# Altium schematic sheet Magneto_diagnostics.SchDoc: Magneto
size 420 x 297 mm; Author: G.Kasprowicz; CompanyName: WUT ISE; DrawnBy: G.Kasprowicz; Organization: WUT ISE; Address1: PW ISE; Address2: Nowowiejska 15/19 00-665 Warsaw; Address3: gkasprow@gmail.com; DocumentNumber: 7; Revision: 2; SheetNumber: 7; SheetTotal: 7; ModifiedBy: -; CheckedDate: -; Title2: diagnostics; DivGrp: WUT ISE; Designer: G.Kasprowicz; ModifiedDate: -; ProjectName: Sensor Box
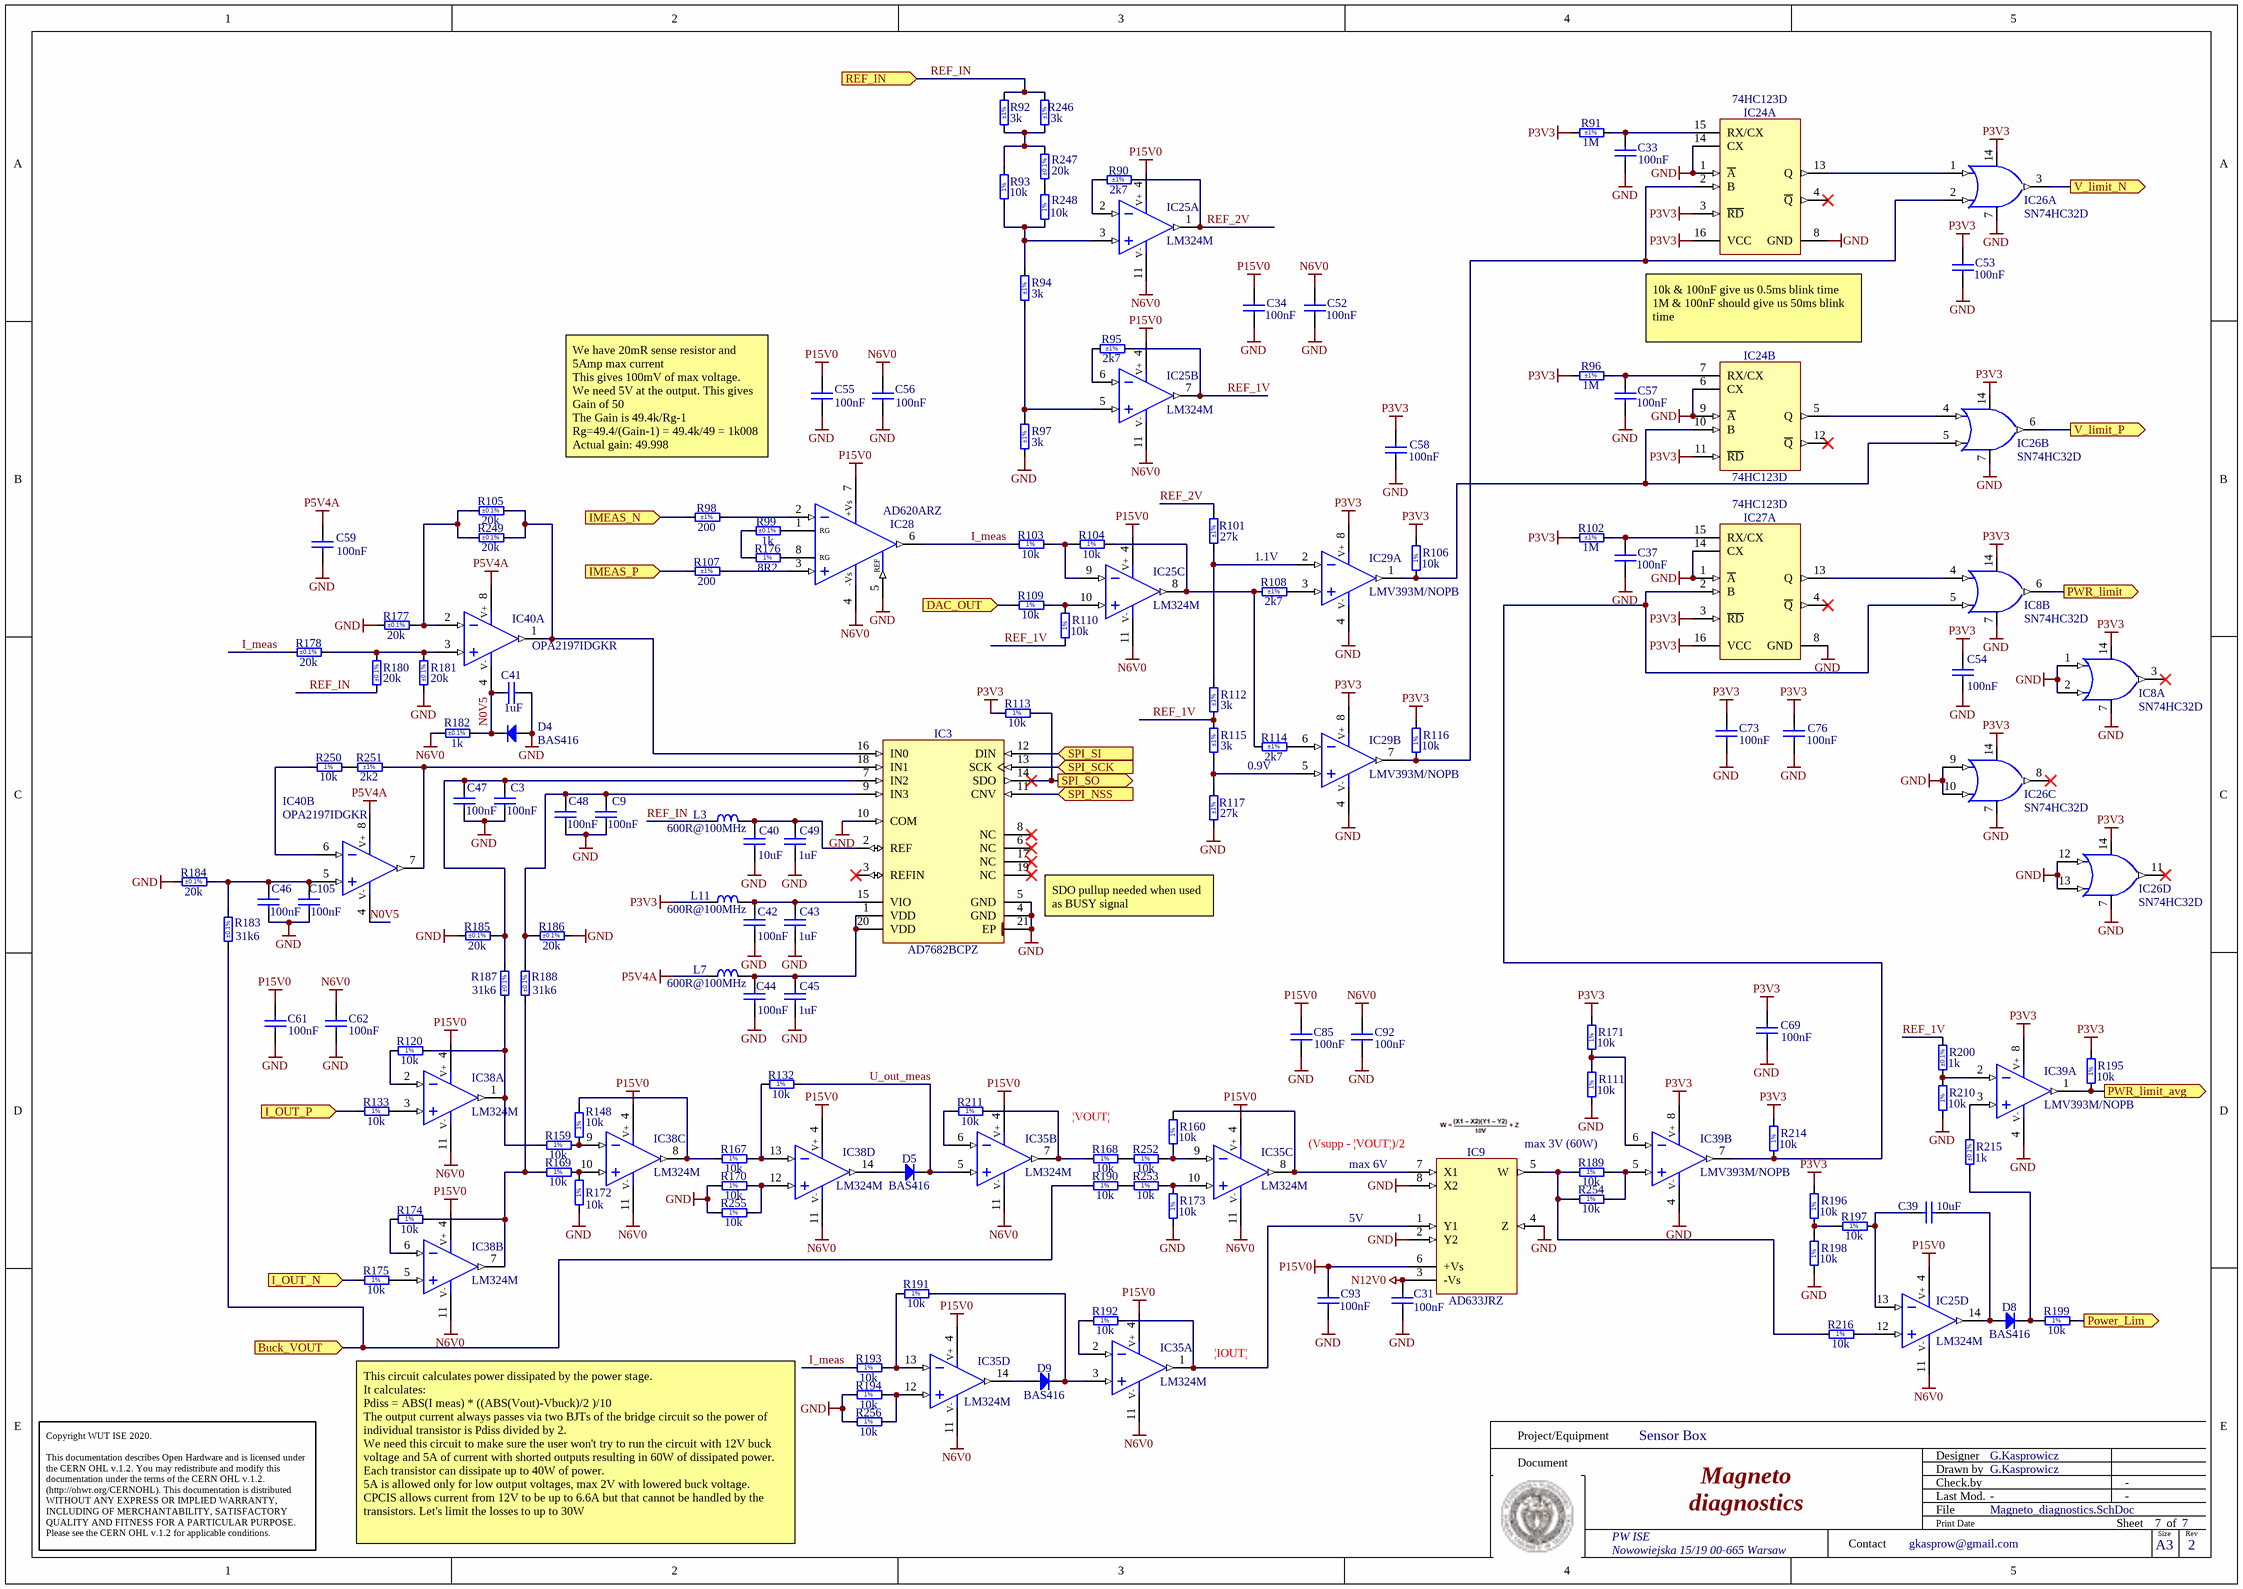
[diagram p0: Magneto_diagnostics.SchDoc]

## Parts
C3  100nF  [CAPC1005X55N]
C9  100nF  [CAPC1005X55N]
C31  100nF  [CAPC1005X55N]
C33  100nF  [CAPC1005X55N]
C34  100nF  [CAPC1005X55N]
C37  100nF  [CAPC1005X55N]
C39  10uF  [CAPC1608X80N]
C40  10uF  [CAPC1608X80N]
C41  1uF  [CAPC1608X87N]
C42  100nF  [CAPC1005X55N]
C43  1uF  [CAPC1608X87N]
C44  100nF  [CAPC1005X55N]
C45  1uF  [CAPC1608X87N]
C46  100nF  [CAPC1005X55N]
C47  100nF  [CAPC1005X55N]
C48  100nF  [CAPC1005X55N]
C49  1uF  [CAPC1608X87N]
C52  100nF  [CAPC1005X55N]
C53  100nF  [CAPC1005X55N]
C54  100nF  [CAPC1005X55N]
C55  100nF  [CAPC1005X55N]
C56  100nF  [CAPC1005X55N]
C57  100nF  [CAPC1005X55N]
C58  100nF  [CAPC1005X55N]
C59  100nF  [CAPC1005X55N]
C61  100nF  [CAPC1005X55N]
C62  100nF  [CAPC1005X55N]
C69  100nF  [CAPC1005X55N]
C73  100nF  [CAPC1005X55N]
C76  100nF  [CAPC1005X55N]
C85  100nF  [CAPC1005X55N]
C92  100nF  [CAPC1005X55N]
C93  100nF  [CAPC1005X55N]
C105  100nF  [CAPC1005X55N]
D4  BAS416  [SOD2512X110N]
D5  BAS416  [SOD2512X110N]
D8  BAS416  [SOD2512X110N]
D9  BAS416  [SOD2512X110N]
IC3  AD7682BCPZ  [QFN50P400X400X80-21N-S265]
IC8  SN74HC32D  [SOIC127P600X175-14N]  (parts A,B of 4)
IC9  AD633JRZ  [SOIC127P600X175-8N]
IC24  74HC123D  [SOIC127P600X175-16N]  (parts A,B of 2)
IC25  LM324M  [SOIC127P600X175-14N]  (parts A,B,C,D of 4)
IC26  SN74HC32D  [SOIC127P600X175-14N]  (parts A,B,C,D of 4)
IC27  74HC123D  [SOIC127P600X175-16N]  (part A of 2)
IC28  AD620ARZ  [SOIC127P600X175-8N]
IC29  LMV393M/NOPB  [SOIC127P600X175-8N]  (parts A,B of 2)
IC35  LM324M  [SOIC127P600X175-14N]  (parts A,B,C,D of 4)
IC38  LM324M  [SOIC127P600X175-14N]  (parts A,B,C,D of 4)
IC39  LMV393M/NOPB  [SOIC127P600X175-8N]  (parts A,B of 2)
IC40  OPA2197IDGKR  [SOP65P490X110-8N]  (parts A,B of 2)
L3  600R@100MHz  [INDC1005X55N]
L7  600R@100MHz  [INDC1005X55N]
L11  600R@100MHz  [INDC1005X55N]
R90  2k7  Tolerance: ±1%  [RESC1608X55N]
R91  1M  Tolerance: ±1%  [RESC1608X55N]
R92  3k  Tolerance: ±1%  [RESC1005X40N]
R93  10k  [RESC1005X40N]
R94  3k  Tolerance: ±1%  [RESC1005X40N]
R95  2k7  Tolerance: ±1%  [RESC1608X55N]
R96  1M  Tolerance: ±1%  [RESC1608X55N]
R97  3k  Tolerance: ±1%  [RESC1005X40N]
R98  200  Tolerance: ±1%  [RESC1608X55N]
R99  1k  Tolerance: ±0.1%  [RESC1608X55N]
R101  27k  Tolerance: ±1%  [RESC1608X55N]
R102  1M  Tolerance: ±1%  [RESC1608X55N]
R103  10k  [RESC1005X40N]
R104  10k  [RESC1005X40N]
R105  20k  Tolerance: ±0.1%  [RESC1608X55N]
R106  10k  [RESC1005X40N]
R107  200  Tolerance: ±1%  [RESC1608X55N]
R108  2k7  Tolerance: ±1%  [RESC1608X55N]
R109  10k  [RESC1005X40N]
R110  10k  [RESC1005X40N]
R111  10k  [RESC1005X40N]
R112  3k  Tolerance: ±1%  [RESC1005X40N]
R113  10k  [RESC1005X40N]
R114  2k7  Tolerance: ±1%  [RESC1608X55N]
R115  3k  Tolerance: ±1%  [RESC1005X40N]
R116  10k  [RESC1005X40N]
R117  27k  Tolerance: ±1%  [RESC1608X55N]
R120  10k  [RESC1005X40N]
R132  10k  [RESC1005X40N]
R133  10k  [RESC1005X40N]
R148  10k  [RESC1005X40N]
R159  10k  [RESC1005X40N]
R160  10k  [RESC1005X40N]
R167  10k  [RESC1005X40N]
R168  10k  [RESC1005X40N]
R169  10k  [RESC1005X40N]
R170  10k  [RESC1005X40N]
R171  10k  [RESC1005X40N]
R172  10k  [RESC1005X40N]
R173  10k  [RESC1005X40N]
R174  10k  [RESC1005X40N]
R175  10k  [RESC1005X40N]
R176  8R2  [RESC1608X55N]
R177  20k  Tolerance: ±0.1%  [RESC1608X55N]
R178  20k  Tolerance: ±0.1%  [RESC1608X55N]
R180  20k  Tolerance: ±0.1%  [RESC1608X55N]
R181  20k  Tolerance: ±0.1%  [RESC1608X55N]
R182  1k  Tolerance: ±0.1%  [RESC1608X55N]
R183  31k6  Tolerance: ±0.1%  [RESC1005X35N]
R184  20k  Tolerance: ±0.1%  [RESC1608X55N]
R185  20k  Tolerance: ±0.1%  [RESC1608X55N]
R186  20k  Tolerance: ±0.1%  [RESC1608X55N]
R187  31k6  Tolerance: ±0.1%  [RESC1005X35N]
R188  31k6  Tolerance: ±0.1%  [RESC1005X35N]
R189  10k  [RESC1005X40N]
R190  10k  [RESC1005X40N]
R191  10k  [RESC1005X40N]
R192  10k  [RESC1005X40N]
R193  10k  [RESC1005X40N]
R194  10k  [RESC1005X40N]
R195  10k  [RESC1005X40N]
R196  10k  [RESC1005X40N]
R197  10k  [RESC1005X40N]
R198  10k  [RESC1005X40N]
R199  10k  [RESC1005X40N]
R200  1k  Tolerance: ±0.1%  [RESC1608X55N]
R210  10k  [RESC1005X40N]
R211  10k  [RESC1005X40N]
R214  10k  [RESC1005X40N]
R215  1k  Tolerance: ±0.1%  [RESC1608X55N]
R216  10k  [RESC1005X40N]
R246  3k  Tolerance: ±1%  [RESC1005X40N]
R247  20k  Tolerance: ±0.1%  [RESC1608X55N]
R248  10k  [RESC1005X40N]
R249  20k  Tolerance: ±0.1%  [RESC1608X55N]
R250  10k  [RESC1005X40N]
R251  2k2  Tolerance: ±1%  [RESC1608X55N]
R252  10k  [RESC1005X40N]
R253  10k  [RESC1005X40N]
R254  10k  [RESC1005X40N]
R255  10k  [RESC1005X40N]
R256  10k  [RESC1005X40N]

## Ports
Buck_VOUT (in), DAC_OUT (in), I_OUT_N (in), I_OUT_P (in), IMEAS_N (in), IMEAS_P (in), Power_Lim (out), PWR_limit (out), PWR_limit_avg (out), REF_IN (in), SPI_NSS (in), SPI_SCK (in), SPI_SI (in), SPI_SO (out), V_limit_N (out), V_limit_P (out)

## Nets
GND: C3.1 C9.1 C31.1 C33.1 C34.1 C37.1 C40.1 C41.1 C42.1 C43.1 C44.1 C45.1 C46.1 C47.1 C48.1 C49.1 C52.1 C53.1 C54.1 C55.1 C56.1 C57.1 C58.1 C59.1 C61.1 C62.1 C69.1 C73.1 C76.1 C85.1 C92.1 C93.1 C105.1 D4.2(A) IC3.4(GND) IC3.5(GND) IC3.10(COM) IC3.21(EP) IC8.1(A) IC8.2(B) IC8.7(GND) IC9.2(Y2) IC9.4(Z) IC9.8(X2) IC24.1(~{A}) IC24.6(CX) IC24.8(GND) IC24.9(~{A}) IC24.14(CX) IC26.7(GND) IC26.9(A) IC26.10(B) IC26.12(A) IC26.13(B) IC27.1(~{A}) IC27.8(GND) IC27.14(CX) IC28.5(REF) IC29.4(V-) IC39.4(V-) R97.1 R111.1 R117.1 R170.1 R172.1 R173.1 R177.1 R181.1 R184.1 R185.1 R186.2 R194.1 R198.1 R210.1 R255.1 R256.1
N6V0: C52.2 C56.2 C62.2 C92.2 IC25.11(V-) IC28.4(-Vs) IC35.11(V-) IC38.11(V-) R182.1
N12V0: C31.2 IC9.3(-Vs)
P3V3: C53.2 C54.2 C58.2 C69.2 C73.2 C76.2 IC8.14(VCC) IC24.3(~{RD}) IC24.11(~{RD}) IC24.16(VCC) IC26.14(VCC) IC27.3(~{RD}) IC27.16(VCC) IC29.8(V+) IC39.8(V+) L11.1 R91.1 R96.1 R102.1 R106.2 R113.1 R116.2 R171.2 R195.2 R196.2 R214.2
P5V4A: C59.2 IC40.8(V+) L7.1
P15V0: C34.2 C55.2 C61.2 C85.2 C93.2 IC9.6(+Vs) IC25.4(V+) IC28.7(+Vs) IC35.4(V+) IC38.4(V+)
Buck_VOUT: R183.1 R190.1 ; port Buck_VOUT
DAC_OUT: R109.1 ; port DAC_OUT
I_meas: IC28.6(Vout) R103.1 R178.1 R193.1
I_OUT_N: R175.1 ; port I_OUT_N
I_OUT_P: R133.1 ; port I_OUT_P
IMEAS_N: R98.1 ; port IMEAS_N
IMEAS_P: R107.1 ; port IMEAS_P
N0V5: C41.2 D4.1(C) IC40.4(V-) R182.2
Power_Lim: R199.2 ; port Power_Lim
PWR_limit: IC8.6(Y) ; port PWR_limit
PWR_limit_avg: IC39.1(OUT) R195.1 ; port PWR_limit_avg
REF_1V: IC25.7(OUT) R95.2 R110.1 R112.1 R115.2 R200.2
REF_2V: IC25.1(OUT) R90.2 R101.2
REF_IN: L3.1 R92.2 R180.1 R246.2 ; port REF_IN
SPI_NSS: IC3.11(CNV) ; port SPI_NSS
SPI_SCK: IC3.13(SCK) ; port SPI_SCK
SPI_SI: IC3.12(DIN) ; port SPI_SI
SPI_SO: IC3.14(SDO) R113.2 ; port SPI_SO
U_out_meas: D5.1(C) IC35.5(IN+) R132.2
V_limit_N: IC26.3(Y) ; port V_limit_N
V_limit_P: IC26.6(Y) ; port V_limit_P
NetC3_2: C3.2 C47.2 IC3.7(IN2) R185.2 R187.2
NetC9_2: C9.2 C48.2 IC3.9(IN3) R186.1 R188.2
NetC33_2: C33.2 IC24.15(RX/CX) R91.2
NetC37_2: C37.2 IC27.15(RX/CX) R102.2
NetC39_1: C39.1 D8.2(A) IC25.14(OUT)
NetC39_2: C39.2 IC25.13(IN-) R197.2
NetC40_2: C40.2 C49.2 IC3.2(REF) L3.2
NetC42_2: C42.2 C43.2 IC3.15(VIO) L11.2
NetC44_2: C44.2 C45.2 IC3.1(VDD) IC3.20(VDD) L7.2
NetC46_2: C46.2 C105.2 IC40.5(IN+) R183.2 R184.2
NetC57_2: C57.2 IC24.7(RX/CX) R96.2
NetD5_2: D5.2(A) IC38.14(OUT)
NetD8_1: D8.1(C) R199.1 R215.1
NetD9_1: D9.1(C) IC35.3(IN+) R191.2
NetD9_2: D9.2(A) IC35.14(OUT)
NetIC3_16: IC3.16(IN0) IC40.1(OUT) R105.2 R249.2
NetIC3_18: IC3.18(IN1) IC40.7(OUT) R251.2
NetIC8_4: IC8.4(A) IC27.13(Q)
NetIC8_5: IC8.5(B) IC27.2(B) IC39.7(OUT) R214.1
NetIC9_1: IC9.1(Y1) IC35.1(OUT) R192.2
NetIC9_5: IC9.5(W) R189.1 R216.1 R254.1
NetIC9_7: IC9.7(X1) IC35.8(OUT) R160.2
NetIC24_2: IC24.2(B) IC26.2(B) IC29.7(OUT) R116.1
NetIC24_5: IC24.5(Q) IC26.4(A)
NetIC24_10: IC24.10(B) IC26.5(B) IC29.1(OUT) R106.1
NetIC24_13: IC24.13(Q) IC26.1(A)
NetIC25_2: IC25.2(IN-) R90.1
NetIC25_3: IC25.3(IN+) R93.1 R94.2 R248.1
NetIC25_5: IC25.5(IN+) R94.1 R97.2
NetIC25_6: IC25.6(IN-) R95.1
NetIC25_8: IC25.8(OUT) R104.2 R108.1 R114.1
NetIC25_9: IC25.9(IN-) R103.2 R104.1
NetIC25_10: IC25.10(IN+) R109.2 R110.2
NetIC25_12: IC25.12(IN+) R216.2
NetIC28_1: IC28.1(-RG) R99.2
NetIC28_2: IC28.2(-IN) R98.2
NetIC28_3: IC28.3(+IN) R107.2
NetIC28_8: IC28.8(+RG) R176.2
NetIC29_2: IC29.2(IN-) R101.1 R112.2
NetIC29_3: IC29.3(IN+) R108.2
NetIC29_5: IC29.5(IN+) R115.1 R117.2
NetIC29_6: IC29.6(IN-) R114.2
NetIC35_2: IC35.2(IN-) R192.1
NetIC35_6: IC35.6(IN-) R211.1
NetIC35_7: IC35.7(OUT) R168.1 R211.2
NetIC35_9: IC35.9(IN-) R160.1 R252.2
NetIC35_10: IC35.10(IN+) R173.2 R253.2
NetIC35_12: IC35.12(IN+) R194.2 R256.2
NetIC35_13: IC35.13(IN-) R191.1 R193.2
NetIC38_1: IC38.1(OUT) R120.2 R159.1 R187.1
NetIC38_2: IC38.2(IN-) R120.1
NetIC38_3: IC38.3(IN+) R133.2
NetIC38_5: IC38.5(IN+) R175.2
NetIC38_6: IC38.6(IN-) R174.1
NetIC38_7: IC38.7(OUT) R169.1 R174.2 R188.1
NetIC38_8: IC38.8(OUT) R148.2 R167.1
NetIC38_9: IC38.9(IN-) R148.1 R159.2
NetIC38_10: IC38.10(IN+) R169.2 R172.2
NetIC38_12: IC38.12(IN+) R170.2 R255.2
NetIC38_13: IC38.13(IN-) R132.1 R167.2
NetIC39_2: IC39.2(IN-) R200.1 R210.2
NetIC39_3: IC39.3(IN+) R215.2
NetIC39_5: IC39.5(IN+) R189.2 R254.2
NetIC39_6: IC39.6(IN-) R111.2 R171.1
NetIC40_2: IC40.2(IN-) R105.1 R177.2 R249.1
NetIC40_3: IC40.3(IN+) R178.2 R180.2 R181.2
NetIC40_6: IC40.6(IN-) R250.1
NetR92_1: R92.1 R93.2 R246.1 R247.2
NetR99_1: R99.1 R176.1
NetR168_2: R168.2 R252.1
NetR190_2: R190.2 R253.1
NetR196_1: R196.1 R197.1 R198.2
NetR247_1: R247.1 R248.2
NetR250_2: R250.2 R251.1

Not connected (* = marked no-connect by the designer): IC3 3(REFIN)* 6(NC)* 8(NC)* 17(NC)* 19(NC)*; IC8 3(Y)*; IC24 4(~{Q})* 12(~{Q})*; IC26 8(Y)* 11(Y)*; IC27 4(~{Q})*

## Notes on the sheet
- (near IC24) 10k & 100nF give us 0.5ms blink time
  1M & 100nF should give us 50ms blink time
- We have 20mR sense resistor and 5Amp max current
  This gives 100mV of max voltage.
  We need 5V at the output. This gives Gain of 50
  The Gain is 49.4k/Rg-1
  Rg=49.4/(Gain-1) = 49.4k/49 = 1k008
  Actual gain: 49.998
- 1.1V
- (near R114) 0.9V
- SDO pullup needed when used as BUSY signal
- |VOUT|
- (Vsupp - |VOUT|)/2
- max 6V
- max 3V (60W)
- 5V
- (near IC35) |IOUT|
- This circuit calculates power dissipated by the power stage.
  It calculates:
  Pdiss = ABS(I meas) * ((ABS(Vout)-Vbuck)/2 )/10
  The output current always passes via two BJTs of the bridge circuit so the power of individual transistor is Pdiss divided by 2.
  We need this circuit to make sure the user won't try to run the circuit with 12V buck voltage and 5A of current with shorted outputs resulting in 60W of dissipated power. Each transistor can dissipate up to 40W of power.
  5A is allowed only for low output voltages, max 2V with lowered buck voltage.
  CPCIS allows current from 12V to be up to 6.6A but that cannot be handled by the transistors. Let's limit the losses to up to 30W
- Project/Equipment
- Document
- Designer
- Drawn by
- Check.by
- Copyright WUT ISE 2020.
  This documentation describes Open Hardware and is licensed under the CERN OHL v.1.2. You may redistribute and modify this documentation under the terms of the CERN OHL v.1.2. (http://ohwr.org/CERNOHL). This documentation is distributed WITHOUT ANY EXPRESS OR IMPLIED WARRANTY, INCLUDING OF MERCHANTABILITY, SATISFACTORY QUALITY AND FITNESS FOR A PARTICULAR PURPOSE. Please see the CERN OHL v.1.2 for applicable conditions.
- Contact
- File
- Last Mod.
- Print Date
- Sheet
- Size
- A3
- of
- Rev
- (in symbol AD620ARZ) RG
- (in symbol R0402_10K_1%_0.0625W_100PPM) 1%
- (in symbol R0603_8R2_1%_0.1W_200PPM) 1%

## Library data of the parts
C3 C9 C31 C33 C34 C37 C42 C44 C46-C48 C52-C59 C61 C62 C69 C73 C76 C85 C92 C93 C105 = CC0402_100NF_16V_10%_X5R: Non-polarised capacitor; Part Description: SMD Multilayer Chip Ceramic Capacitor; Manufacturer: GENERIC; Manufacturer1 Part Number: GRM155R61C104KA88D; Voltage: 16V; TC: X5R; Tolerance: ±10%; Part Number: CC0402_100NF_16V_10%_X5R; Component Kind: Standard; Component Type: Standard; Pin Count: 2; Value: 100nF; Status: None; Manufacturer Part Number: CC0402_100NF_16V_10%_X5R; Case: 0402; Mounted: Yes; Socket: No; SMD: Yes; Sense: No; Manufacturer1 Example: MURATA; Manufacturer1 ComponentHeight: 0.55mm; HelpURL: \\cern.ch\dfs\Applications\Altium\Datasheets\CC0402_X5R_MURATA_GRM.pdf; Author: CERN DEM JLC; CreateDate: 10.12.2013; LatestRevisionDate: 10.12.2013
C39 C40 = CC0603_10UF_16V_20%_X5R: Non-polarised capacitor; Part Description: SMD Multilayer Chip Ceramic Capacitor; Manufacturer: GENERIC; Manufacturer1 Part Number: GRM188R61C106MA73D; Voltage: 16V; TC: X5R; Tolerance: ±20%; Part Number: CC0603_10UF_16V_20%_X5R; Component Kind: Standard; Component Type: Standard; Pin Count: 2; Value: 10uF; Status: None; Manufacturer Part Number: CC0603_10UF_16V_20%_X5R; Case: 0603; Mounted: Yes; Socket: No; SMD: Yes; Sense: No; Manufacturer1 Example: MURATA; Manufacturer1 ComponentHeight: 0.8mm; HelpURL: \\cern.ch\dfs\Applications\Altium\Datasheets\CC0603_X5R_MURATA_GRM.pdf; Author: CERN DEM MR; CreateDate: 02.03.2016; LatestRevisionDate: 02.03.2016
C41 C43 C45 C49 = CC0603_1UF_25V_10%_X7R: Non-polarised capacitor; Part Description: SMD Multilayer Chip Ceramic Capacitor; Manufacturer: GENERIC; Manufacturer1 Part Number: GCM188R71E105KA64D; Voltage: 25V; TC: X7R; Tolerance: ±10%; Part Number: CC0603_1UF_25V_10%_X7R; Component Kind: Standard; Component Type: Standard; Pin Count: 2; Value: 1uF; Status: None; Manufacturer Part Number: CC0603_1UF_25V_10%_X7R; Case: 0603; Mounted: Yes; Socket: No; SMD: Yes; Sense: No; Manufacturer1 Example: MURATA; Manufacturer1 ComponentHeight: 0.9mm; HelpURL: \\cern.ch\dfs\Applications\Altium\Datasheets\CC0603_X7R_MURATA.pdf; Author: CERN DEM JLC; CreateDate: 18.01.2011; LatestRevisionDate: 18.01.2011
D4 D5 D8 D9 = BAS416: Diode; Part Description: Low-Leakage Diode; Manufacturer1: NXP SEMICONDUCTORS; Manufacturer1 Part Number: BAS416,115; Voltage: 75V; Power: 200mA; PressFit: No; Bonding: No; Part Number: BAS416; Component Kind: Standard; Component Type: Standard; Device: BAS416; PackageDescription: Small Outline Diode (SOD-323), 1.70mm W X 1.25mm L X 1.10mm H body,  IPC Medium Density; Pin Count: 2; Case: SOD-323; Mounted: Yes; Socket: No; SMD: Yes; Sense: No; ComponentHeight: 1.1mm; HelpURL: \\cern.ch\dfs\Applications\Altium\Datasheets\BAS416.pdf; Author: CERN DEM JLC; CreateDate: 01.10.2013; LatestRevisionDate: 01.10.2013
IC3 = AD7682BCPZ: 16-Bit, 4-Channel, 250 kSPS PulSAR ADC; Manufacturer1: ANALOG DEVICES; Manufacturer1 Part Number: AD7682BCPZRL7; PressFit: No; Bonding: No; Part Number: AD7682BCPZ; Component Kind: Standard; Component Type: Standard; Device: AD7682BCPZ; PackageDescription: QFN, 0.50mm Pitch, Square; 20 Pin, 4.00mm L X 4.00mm W X 0.80mm H Body (w/Thermal Tab 2.75 X 2.75mm), IPC Medium Density; Part Description: 16-Bit, 4-Channel, 250 kSPS PulSAR ADC; Pin Count: 21; Case: QFN20; Mounted: Yes; Socket: No; SMD: Yes; Sense: No; ComponentHeight: 0.8mm; Author: CERN DEM JLC; HelpURL: \\cern.ch\dfs\Applications\Altium\Datasheets\AD7682BCPZ.pdf; CreateDate: 21.08.2017; LatestRevisionDate: 23.03.2022
IC8 IC26 = SN74HC32D: Quad 2-Input OR Gate; Part Description: Quadruple 2-Input Positive-OR Gate; Manufacturer1: TEXAS INSTRUMENTS; PressFit: No; Bonding: No; Part Number: SN74HC32D; Component Kind: Standard; Component Type: Standard; Device: SN74HC32D; PackageDescription: SOIC 14, Pitch 1.27mm - Body 4x8.75mm, IPC Medium Density; Manufacturer1 Part Number: SN74HC32D; Pin Count: 14; Case: SOIC14; Mounted: Yes; Socket: No; SMD: Yes; Sense: No; ComponentHeight: 1.75mm; Author: CERN DEM JLC; HelpURL: \\cern.ch\dfs\Applications\Altium\Datasheets\SN74HC32D.pdf; CreateDate: 18/03/2014; LatestRevisionDate: 18/03/2014
IC9 = AD633JRZ: Low Cost Analog Multiplier; Manufacturer1: ANALOG DEVICES; PressFit: No; Bonding: No; Part Number: AD633JRZ; Component Kind: Standard; Component Type: Standard; Device: AD633JRZ; PackageDescription: SOIC 8, Pitch 1.27mm - Body 4x5mm, IPC Medium Density; Part Description: Low Cost Analog Multiplier; Manufacturer1 Part Number: AD633JRZ; Pin Count: 8; Case: SOIC8; Mounted: Yes; Socket: No; SMD: Yes; Sense: No; ComponentHeight: 1.75mm; Author: CERN DEM JLC; HelpURL: \\cern.ch\dfs\Applications\Altium\Datasheets\AD633JRZ.pdf; CreateDate: 16.01.2012; LatestRevisionDate: 24.03.2022
IC24 IC27 = 74HC123D: Retriggerable Monostable Multivibrator; Part Description: Dual Retriggerable Monostable Multivibrator with Reset; Manufacturer1: NEXPERIA; PressFit: No; Bonding: No; Part Number: 74HC123D; Component Kind: Standard; Component Type: Standard; Device: 74HC123D; PackageDescription: SOIC 16, Pitch 1.27mm - Body 4x10mm, IPC Medium Density; Manufacturer1 Part Number: 74HC123D; Pin Count: 16; Case: SOIC16; Mounted: Yes; Socket: No; SMD: Yes; Sense: No; ComponentHeight: 1.75mm; Author: CERN DEM BC; HelpURL: \\cern.ch\dfs\Applications\Altium\Datasheets\74HC123D.pdf; CreateDate: 21.04.2020; LatestRevisionDate: 21.04.2020
IC25 IC35 IC38 = LM324M: Quad Operational Amplifier; Manufacturer1: Texas Instruments; Manufacturer1 Part Number: LM324M/NOPB; PressFit: No; Bonding: No; Part Number: LM324M; Component Kind: Standard; Component Type: Standard; Device: LM324M; PackageDescription: SOIC 14, Pitch 1.27mm - Body 4x8.75mm, IPC Medium Density; Status: Not recommended; Part Description: Quad Operational Amplifier; Pin Count: 14; Case: SOIC14; Mounted: Yes; Socket: No; SMD: Yes; Sense: No; ComponentHeight: 1.80mm; Author: CERN DEM JLC; HelpURL: \\cern.ch\dfs\Applications\Altium\Datasheets\LM324M.pdf; CreateDate: 20.08.2008; LatestRevisionDate: 20.08.2008
IC28 = AD620ARZ: Low Cost Low Power Instrumentation Amplifier; Manufacturer1: ANALOG DEVICES; Manufacturer1 Part Number: AD620ARZ-REEL7; PressFit: No; Bonding: No; Part Number: AD620ARZ; Component Kind: Standard; Component Type: Standard; Device: AD620ARZ; PackageDescription: SOIC 8, Pitch 1.27mm - Body 4x5mm, IPC Medium Density; Part Description: Low Cost Low Power Instrumentation Amplifier; Pin Count: 8; Case: SOIC8; Mounted: Yes; Socket: No; SMD: Yes; Sense: No; ComponentHeight: 1.75mm; Author: CERN DEM JLC; HelpURL: \\cern.ch\dfs\Applications\Altium\Datasheets\AD620ARZ.pdf; CreateDate: 13.02.2017; LatestRevisionDate: 29.03.2022
IC29 IC39 = LMV393M/NOPB: Dual Operational Amplifier; Part Description: Dual General Purpose, Low Voltage, Tiny Pack Comparator; Manufacturer1: TEXAS INSTRUMENTS; PressFit: No; Bonding: No; Part Number: LMV393M/NOPB; Component Kind: Standard; Component Type: Standard; Device: LMV393M/NOPB; PackageDescription: SOIC 8, Pitch 1.27mm - Body 4x5mm, IPC Medium Density; Manufacturer1 Part Number: LMV393M/NOPB; Pin Count: 8; Case: SOIC8; Mounted: Yes; Socket: No; SMD: Yes; Sense: No; ComponentHeight: 1.75mm; Author: CERN DEM JLC; HelpURL: \\cern.ch\dfs\Applications\Altium\Datasheets\LMV393M-NOPB.pdf; CreateDate: 29.11.2012; LatestRevisionDate: 01.06.2022
IC40 = OA_OPA2197IDGKR: 36-V, Precision, Rail-to-Rail Input Output, Low Offset Voltage Op Amp 8-VSSOP; Part Description: High-Precision, Low-Noise, Rail-to-Rail Output,10-MHz Op Amp; Manufacturer1: TEXAS INSTRUMENTS; PressFit: No; Bonding: No; Part Number: OPA2197IDGKR; Component Kind: Standard; Component Type: Standard; Device: OPA2197IDGKR; PackageDescription: SOP, 0.65mm pitch; 8 pin, 3.00mm W X 3.00mm L X 1.10mm H body, IPC Medium Density; Manufacturer1 Part Number: OPA2197IDGKR; Pin Count: 8; Case: MSOP8; Mounted: Yes; Socket: No; SMD: Yes; Sense: No; ComponentHeight: 1.1mm; Author: GK; HelpURL: \\cern.ch\dfs\Applications\Altium\Datasheets\OPA2140AIDGK.pdf; CreateDate: 20.04.2017; LatestRevisionDate: 20.04.2017
L3 L7 L11 = IND0402_MURATA_BLM15HD601SN1: Inductor; Part Description: SMD EMIFIL Suppression Chip Ferrite Bead; Manufacturer1: MURATA; Manufacturer1 Part Number: BLM15HD601SN1D; Power: 300mA; Resistance: 0.85R; Tolerance: ±25%; Part Number: IND0402_MURATA_BLM15HD601SN1; Component Kind: Standard; Component Type: Standard; Pin Count: 2; Value: 600R@100MHz; Status: None; Case: 0402; Mounted: Yes; Socket: No; SMD: Yes; Sense: No; ComponentHeight: 0.55mm; HelpURL: \\cern.ch\dfs\Applications\Altium\Datasheets\IND0402_MURATA_BLM15H.pdf; Author: CERN DEM JLC; CreateDate: 28/02/2012; LatestRevisionDate: 28/02/2012
R90 R95 R108 R114 = R0603_2K7_1%_0.1W_100PPM: Resistor - 1%; Part Description: General Purpose Thick Film Chip Resistor; Manufacturer: GENERIC; Manufacturer1: YAGEO PHYCOMP; Manufacturer1 Part Number: RC0603FR-072K7L; Power: 0.1W; TC: ±100ppm/°C; PressFit: No; Part Number: R0603_2K7_1%_0.1W_100PPM; Component Kind: Standard; Component Type: Standard; Pin Count: 2; Value: 2k7; Status: Preferred; Manufacturer Part Number: R0603_2K7_1%_0.1W_100PPM; Case: 0603; Mounted: Yes; Sense: No; Socket: No; SMD: Yes; Manufacturer1 ComponentHeight: 0.55mm; HelpURL: \\cern.ch\dfs\Applications\Altium\Datasheets\R0603_PHYCOMP_RC0603.pdf; Author: CERN DEM JLC; CreateDate: 02.05.2011; LatestRevisionDate: 02.05.2011
R91 R96 R102 = R0603_1M_1%_0.1W_100PPM: Resistor - 1%; Part Description: General Purpose Thick Film Chip Resistor; Manufacturer: GENERIC; Manufacturer1: Vishay; Manufacturer1 Part Number: CRCW06031M00FKEA; Power: 0.1W; TC: ±100ppm/°C; PressFit: No; Part Number: R0603_1M_1%_0.1W_100PPM; Component Kind: Standard; Component Type: Standard; Pin Count: 2; Value: 1M; Status: Preferred; Manufacturer Part Number: R0603_1M_1%_0.1W_100PPM; Case: 0603; Mounted: Yes; Sense: No; Socket: No; SMD: Yes; Manufacturer1 ComponentHeight: 0.55mm; HelpURL: \\cern.ch\dfs\Applications\Altium\Datasheets\R0603_NIC_NRC.pdf; Author: CERN DEM JLC; CreateDate: 03.12.2007; LatestRevisionDate: 13.03.2008
R92 R94 R97 R112 R115 R246 = R0402_3K_1%_0.0625W_100PPM: Resistor - 1%; Part Description: General Purpose Thick Film Chip Resistor; Manufacturer: GENERIC; Manufacturer1: Vishay; Manufacturer1 Part Number: RCS04023K00FKED; TC: ±100ppm/°C; PressFit: No; Part Number: R0402_3K_1%_0.0625W_100PPM; Component Kind: Standard; Component Type: Standard; Pin Count: 2; Value: 3k; Status: Not Recommended; Power: 0.0625W; Manufacturer Part Number: R0402_3K_1%_0.0625W_100PPM; Case: 0402; Mounted: Yes; Sense: No; Socket: No; SMD: Yes; Manufacturer1 ComponentHeight: 0.4mm; HelpURL: \\cern.ch\dfs\Applications\Altium\Datasheets\R0402_Phycomp_RC0402.pdf; Author: CERN DEM JLC; CreateDate: 03.12.2007; LatestRevisionDate: 17.10.2012
R93 R103 R104 R106 R109-R111 R113 R116 R120 R132 R133 R148 R159 R160 R167-R175 R189-R199 R210 R211 R214 R216 R248 R250 R252-R256 = R0402_10K_1%_0.0625W_100PPM: Resistor - 1%; Part Description: General Purpose Thick Film Chip Resistor; Manufacturer: GENERIC; Manufacturer1: Vishay; Manufacturer1 Part Number: RCA040210K0FKED; TC: ±100ppm/°C; PressFit: No; Part Number: R0402_10K_1%_0.0625W_100PPM; Component Kind: Standard; Component Type: Standard; Pin Count: 2; Value: 10k; Status: Not Recommended; Power: 0.0625W; Tolerance: ±1%; Manufacturer Part Number: R0402_10K_1%_0.0625W_100PPM; Case: 0402; Mounted: Yes; Sense: No; Socket: No; SMD: Yes; Manufacturer1 ComponentHeight: 0.4mm; HelpURL: \\cern.ch\dfs\Applications\Altium\Datasheets\R0402_Phycomp_RC0402.pdf; Author: CERN DEM JLC; CreateDate: 03.12.2007; LatestRevisionDate: 17.10.2012
R98 R107 = R0603_200R_1%_0.1W_100PPM: Resistor - 1%; Part Description: General Purpose Thick Film Chip Resistor; Manufacturer: GENERIC; Manufacturer1: Vishay; Manufacturer1 Part Number: CRCW0603200RFKEA; Power: 0.1W; TC: ±100ppm/°C; PressFit: No; Part Number: R0603_200R_1%_0.1W_100PPM; Component Kind: Standard; Component Type: Standard; Pin Count: 2; Value: 200; Status: Preferred; Manufacturer Part Number: R0603_200R_1%_0.1W_100PPM; Case: 0603; Mounted: Yes; Sense: No; Socket: No; SMD: Yes; Manufacturer1 ComponentHeight: 0.55mm; HelpURL: \\cern.ch\dfs\Applications\Altium\Datasheets\R0603_NIC_NRC.pdf; Author: CERN DEM JLC; CreateDate: 03.12.2007; LatestRevisionDate: 13.03.2008
R99 R182 R200 R215 = R0603_1K_0.1%_0.063W_10PPM: Resistor - 0.1%; Part Description: Thin Film Chip Resistor; Manufacturer: GENERIC; Manufacturer1: TYCO HOLSWORTHY; Manufacturer1 Part Number: RN73C1J1K0BTG; Power: 0.063W; TC: ±10ppm; PressFit: No; Part Number: R0603_1K_0.1%_0.063W_10PPM; Component Kind: Standard; Component Type: Standard; Pin Count: 2; Value: 1k; Status: Not Recommended; Manufacturer Part Number: R0603_1K_0.1%_0.063W_10PPM; Case: 0603; Mounted: Yes; Sense: No; Socket: No; SMD: Yes; Manufacturer1 ComponentHeight: 0.55mm; HelpURL: \\cern.ch\dfs\Applications\Altium\Datasheets\R0603_Tyco_RN73.pdf; Author: CERN DEM BC; CreateDate: 23.05.2016; LatestRevisionDate: 23.05.2016
R101 R117 = R0603_27K_1%_0.1W_100PPM: Resistor - 1%; Part Description: General Purpose Thick Film Chip Resistor; Manufacturer: GENERIC; Manufacturer1: Vishay; Manufacturer1 Part Number: CRCW060327K0FKEA; Power: 0.1W; TC: ±100ppm/°C; PressFit: No; Part Number: R0603_27K_1%_0.1W_100PPM; Component Kind: Standard; Component Type: Standard; Pin Count: 2; Value: 27k; Status: Preferred; Manufacturer Part Number: R0603_27K_1%_0.1W_100PPM; Case: 0603; Mounted: Yes; Sense: No; Socket: No; SMD: Yes; Manufacturer1 ComponentHeight: 0.55mm; HelpURL: \\cern.ch\dfs\Applications\Altium\Datasheets\R0603_NIC_NRC.pdf; Author: CERN DEM JLC; CreateDate: 03.12.2007; LatestRevisionDate: 13.03.2008
R105 R177 R178 R180 R181 R184-R186 R247 R249 = R0603_20K_0.1%_0.063W_10PPM: Resistor - 0.1%; Part Description: Thin Film Chip Resistor; Manufacturer: GENERIC; Manufacturer1: TYCO HOLSWORTHY; Manufacturer1 Part Number: RN73C1J20KBTDF; Power: 0.063W; TC: ±10ppm; PressFit: No; Part Number: R0603_20K_0.1%_0.063W_10PPM; Component Kind: Standard; Component Type: Standard; Pin Count: 2; Value: 20k; Status: Not Recommended; Manufacturer Part Number: R0603_20K_0.1%_0.063W_10PPM; Case: 0603; Mounted: Yes; Sense: No; Socket: No; SMD: Yes; Manufacturer1 ComponentHeight: 0.5mm; HelpURL: \\cern.ch\dfs\Applications\Altium\Datasheets\R0603_Tyco_RN73.pdf; Author: CERN DEM JLC; CreateDate: 03.12.2007; LatestRevisionDate: 13.03.2008
R176 = R0603_8R2_1%_0.1W_200PPM: Resistor - 1%; Part Description: General Purpose Thick Film Chip Resistor; Manufacturer: GENERIC; Manufacturer1: YAGEO PHYCOMP; Manufacturer1 Part Number: RC0603FR-078R2L; Power: 0.1W; TC: ±200ppm/°C; PressFit: No; Part Number: R0603_8R2_1%_0.1W_200PPM; Component Kind: Standard; Component Type: Standard; Pin Count: 2; Value: 8R2; Status: Preferred; Tolerance: ±1%; Manufacturer Part Number: R0603_8R2_1%_0.1W_200PPM; Case: 0603; Mounted: Yes; Sense: No; Socket: No; SMD: Yes; Manufacturer1 ComponentHeight: 0.65mm; HelpURL: \\cern.ch\dfs\Applications\Altium\Datasheets\R0603_Phycomp_RC0603.pdf; Author: CERN DEM JLC; CreateDate: 03/12/2007; LatestRevisionDate: 17/10/2012
R183 R187 R188 = R0402_31K6_0.1%_0.063W_25PPM_YAGEO_RT: Resistor - 0.1%; Part Description: Thin Film Chip Resistor; Manufacturer1: YAGEO; Manufacturer1 Part Number: RT0402BRD0731K6L; Power: 0.063W; TC: ±25ppm/°C; Voltage: 50V; PressFit: No; Part Number: R0402_31K6_0.1%_0.063W_25PPM_YAGEO_RT; Component Kind: Standard; Component Type: Standard; Pin Count: 2; Value: 31k6; Status: Not Recommended; Case: 0402; Mounted: Yes; Sense: No; Socket: No; SMD: Yes; ComponentHeight: 0.35mm; HelpURL: \\cern.ch\dfs\Applications\Altium\Datasheets\R0402_YAGEO_RT.pdf; Author: CERN DEM BC; CreateDate: 30.07.2020; LatestRevisionDate: 30.07.2020
R251 = R0603_2K2_1%_0.1W_100PPM: Resistor - 1%; Part Description: General Purpose Thick Film Chip Resistor; Manufacturer: GENERIC; Manufacturer1: Vishay; Manufacturer1 Part Number: CRCW06032K20FKEA; Power: 0.1W; TC: ±100ppm/°C; PressFit: No; Part Number: R0603_2K2_1%_0.1W_100PPM; Component Kind: Standard; Component Type: Standard; Pin Count: 2; Value: 2k2; Status: Preferred; Manufacturer Part Number: R0603_2K2_1%_0.1W_100PPM; Case: 0603; Mounted: Yes; Sense: No; Socket: No; SMD: Yes; Manufacturer1 ComponentHeight: 0.55mm; HelpURL: \\cern.ch\dfs\Applications\Altium\Datasheets\R0603_NIC_NRC.pdf; Author: CERN DEM JLC; CreateDate: 03.12.2007; LatestRevisionDate: 13.03.2008